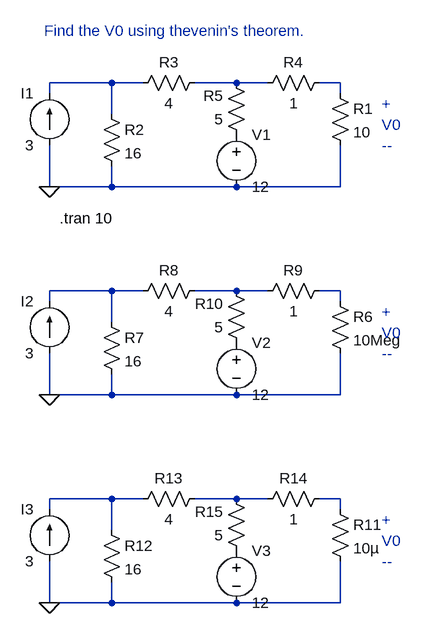
[diagram p0: schematic Lab2_ques3.asc]
Lab2_ques3.asc, the LTspice schematic file:
Version 4
SHEET 1 880 1376
WIRE 80 144 -16 144
WIRE 128 144 80 144
WIRE 272 144 208 144
WIRE 320 144 272 144
WIRE 432 144 400 144
WIRE -16 160 -16 144
WIRE 432 160 432 144
WIRE 80 192 80 144
WIRE -16 304 -16 240
WIRE 80 304 80 272
WIRE 80 304 -16 304
WIRE 272 304 80 304
WIRE 432 304 432 240
WIRE 432 304 272 304
WIRE 80 464 -16 464
WIRE 128 464 80 464
WIRE 272 464 208 464
WIRE 320 464 272 464
WIRE 432 464 400 464
WIRE -16 480 -16 464
WIRE 432 480 432 464
WIRE 80 512 80 464
WIRE -16 624 -16 560
WIRE 80 624 80 592
WIRE 80 624 -16 624
WIRE 272 624 80 624
WIRE 432 624 432 560
WIRE 432 624 272 624
WIRE 80 784 -16 784
WIRE 128 784 80 784
WIRE 272 784 208 784
WIRE 320 784 272 784
WIRE 432 784 400 784
WIRE -16 800 -16 784
WIRE 432 800 432 784
WIRE 80 832 80 784
WIRE -16 944 -16 880
WIRE 80 944 80 912
WIRE 80 944 -16 944
WIRE 272 944 80 944
WIRE 432 944 432 880
WIRE 432 944 272 944
FLAG -16 304 0
FLAG -16 624 0
FLAG -16 944 0
SYMBOL Res 416 144 R0
SYMATTR InstName R1
SYMATTR Value 10
SYMBOL Res 64 176 R0
SYMATTR InstName R2
SYMATTR Value 16
SYMBOL Res 224 128 R90
WINDOW 0 0 56 VBottom 2
WINDOW 3 32 56 VTop 2
SYMATTR InstName R3
SYMATTR Value 4
SYMBOL Res 416 128 R90
WINDOW 0 0 56 VBottom 2
WINDOW 3 32 56 VTop 2
SYMATTR InstName R4
SYMATTR Value 1
SYMBOL Res 288 240 R180
WINDOW 0 36 76 Left 2
WINDOW 3 36 40 Left 2
SYMATTR InstName R5
SYMATTR Value 5
SYMBOL Voltage 272 208 R0
SYMATTR InstName V1
SYMATTR Value 12
SYMBOL current -16 240 R180
WINDOW 0 24 80 Left 2
WINDOW 3 24 0 Left 2
SYMATTR InstName I1
SYMATTR Value 3
SYMBOL Res 416 464 R0
SYMATTR InstName R6
SYMATTR Value 10Meg
SYMBOL Res 64 496 R0
SYMATTR InstName R7
SYMATTR Value 16
SYMBOL Res 224 448 R90
WINDOW 0 0 56 VBottom 2
WINDOW 3 32 56 VTop 2
SYMATTR InstName R8
SYMATTR Value 4
SYMBOL Res 416 448 R90
WINDOW 0 0 56 VBottom 2
WINDOW 3 32 56 VTop 2
SYMATTR InstName R9
SYMATTR Value 1
SYMBOL Res 288 560 R180
WINDOW 0 36 76 Left 2
WINDOW 3 36 40 Left 2
SYMATTR InstName R10
SYMATTR Value 5
SYMBOL Voltage 272 528 R0
SYMATTR InstName V2
SYMATTR Value 12
SYMBOL current -16 560 R180
WINDOW 0 24 80 Left 2
WINDOW 3 24 0 Left 2
SYMATTR InstName I2
SYMATTR Value 3
SYMBOL Res 416 784 R0
SYMATTR InstName R11
SYMATTR Value 10µ
SYMBOL Res 64 816 R0
SYMATTR InstName R12
SYMATTR Value 16
SYMBOL Res 224 768 R90
WINDOW 0 0 56 VBottom 2
WINDOW 3 32 56 VTop 2
SYMATTR InstName R13
SYMATTR Value 4
SYMBOL Res 416 768 R90
WINDOW 0 0 56 VBottom 2
WINDOW 3 32 56 VTop 2
SYMATTR InstName R14
SYMATTR Value 1
SYMBOL Res 288 880 R180
WINDOW 0 36 76 Left 2
WINDOW 3 36 40 Left 2
SYMATTR InstName R15
SYMATTR Value 5
SYMBOL Voltage 272 848 R0
SYMATTR InstName V3
SYMATTR Value 12
SYMBOL current -16 880 R180
WINDOW 0 24 80 Left 2
WINDOW 3 24 0 Left 2
SYMATTR InstName I3
SYMATTR Value 3
TEXT -24 64 Left 2 ;Find the V0 using thevenin's theorem.
TEXT 496 208 Left 2 ;V0
TEXT 496 176 Left 2 ;+
TEXT 504 240 Left 2 ;-
TEXT 496 240 Left 2 ;-
TEXT 496 528 Left 2 ;V0
TEXT 496 496 Left 2 ;+
TEXT 504 560 Left 2 ;-
TEXT 496 560 Left 2 ;-
TEXT 496 848 Left 2 ;V0
TEXT 496 816 Left 2 ;+
TEXT 504 880 Left 2 ;-
TEXT 496 880 Left 2 ;-
TEXT 0 352 Left 2 !.tran 10

The netlist it stands for:
* Lab2_ques3.asc
R1 N003 0 10
R2 N001 0 16
R3 N002 N001 4
R4 N003 N002 1
R5 P001 N002 5
V1 P001 0 12
I1 0 N001 3
R6 N006 0 10Meg
R7 N004 0 16
R8 N005 N004 4
R9 N006 N005 1
R10 P002 N005 5
V2 P002 0 12
I2 0 N004 3
R11 N009 0 10µ
R12 N007 0 16
R13 N008 N007 4
R14 N009 N008 1
R15 P003 N008 5
V3 P003 0 12
I3 0 N007 3
* Find the V0 using thevenin's theorem.
* V0
* +
* -
* -
* V0
* +
* -
* -
* V0
* +
* -
* -
.tran 10
.backanno
.end